# EAGLE design dragonite2 (EAGLE 6.2)
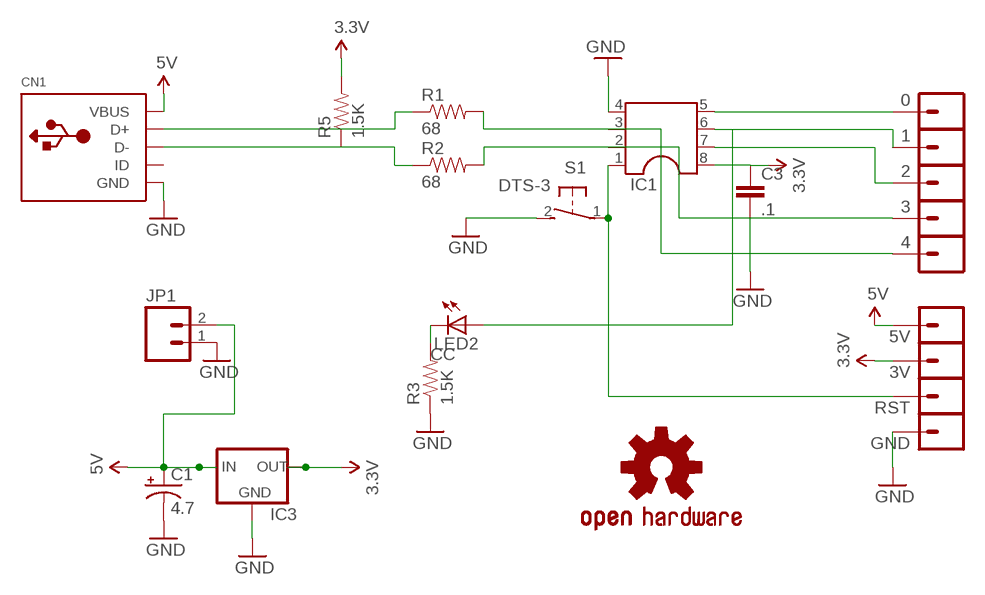
[diagram p0: schematic, sheet 1]

## Parts
0  M01SMDNS  [1X01NS]
1  M01SMDNS  [1X01NS]
2  M01SMDNS  [1X01NS]
3  M01SMDNS  [1X01NS]
3V  M01SMDNS  [1X01NS]
4  M01SMDNS  [1X01NS]
5V  M01SMDNS  [1X01NS]
C1  4.7  CPOL-USE2-4  [E2-4]
C3  .1  CAPEZ  [CAP-PTH-SMALLEZ]
CN1  USBMOLEX  [USB-MINIB-THM-MOLEX]
GND  M01SMDNS  [1X01NS]
IC1  DIL8  [DIL08]
IC3  V_REG_78XXTO-92  [TO-92]
JP1  M02JST-PTH-2  [JST-2-PTH]
LED2  LED3MM  [LED3MM]
R1  68  RESISTORPTH-1/6W  [1/6W-RES]
R2  68  RESISTORPTH-1/6W  [1/6W-RES]
R3  1.5K  RESISTORPTH-1/6W  [1/6W-RES]
R5  1.5K  RESISTORPTH-1/6W  [1/6W-RES]
RST  M01SMDNS  [1X01NS]
S1  DTS-3  [DTS-3]
U$4  OSHW-LOGOS  [OSHW-LOGO-S]

## Nets
3.3V: 3V.1 C3.1 IC1.8 IC3.3(OUT) R5.2
5V: 5V.1 C1.+ CN1.VBUS IC3.2(IN) JP1.2
GND: C1.- C3.2 CN1.GND GND.1 IC1.4 IC3.1(GND) JP1.1 R3.1 S1.2
N$1: CN1.D+ R1.1
N$2: CN1.D- R2.1 R5.1
N$3: LED2.K(C) R3.2
N$5: IC1.1 RST.1 S1.1
N$7: 4.1 IC1.3 R1.2
N$8: 3.1 IC1.2 R2.2
N$9: 0.1 IC1.5
N$10: 1.1 IC1.6 LED2.A
N$11: 2.1 IC1.7
Unconnected: CN1.ID

## Notes on the sheet
- CC

## Library data of the parts
0 1-3 3V 4 5V GND RST = SparkFun:M01: Header 1 Standard 1-pin 0.1" header. Use with straight break away headers (SKU : PRT-00116), right angle break away headers (PRT-00553), swiss pins (PRT-00743), machine pins (PRT-00117), and female headers (PRT-00115).
C1 = adafruit:CPOL-US: POLARIZED CAPACITOR, American symbol
C3 = SparkFun-Capacitors:CAP: Capacitor Standard 0603 ceramic capacitor, and 0.1" leaded capacitor.
CN1 = adafruit:USB: USB Connectors USBMINIB - Surface Mount Female Mini-B USB Connector 4UConnector: 06564 By microbuilder.eu Thru-hole RA Female Mini-B USB Connector 4UConnector: 18732 By ladyada.net
IC1 = ic-package:DIL8: Dual In Line / Socket
IC3 = SteveMarple:V_REG_78XX: Voltage Regulator Standard 7805 5V regulator. IGO (Input Ground Output). Spark Fun Electronics SKU : COM-00107
JP1 = SparkFun:M02: Header 2 Standard 2-pin 0.1" header. Use with straight break away headers (SKU : PRT-00116), right angle break away headers (PRT-00553), swiss pins (PRT-00743), machine pins (PRT-00117), and female headers (PRT-00115). Molex polarized connector foot print use with SKU : PRT-08233 with associated crimp pins and housings.
LED2 = SparkFun-LED:LED: LEDs Standard schematic elements and footprints for 5mm, 3mm, 1206, and 0603 sized LEDs. 5mm - Spark Fun Electronics SKU : COM-00529 (and others)
R1-R3 R5 = SparkFun:RESISTOR: Resistor Basic schematic elements and footprints for 0603, 1206, and PTH resistors.
S1 = switch-tact:DTS-3
U$4 = SparkFun:OSHW-LOGO: Open Source Hardware Logo This logo indicates the piece of hardware it is found on incorporates a OSHW license and/or adheres to the definition of open source hardware found here: http://freedomdefined.org/OSHW

## Board
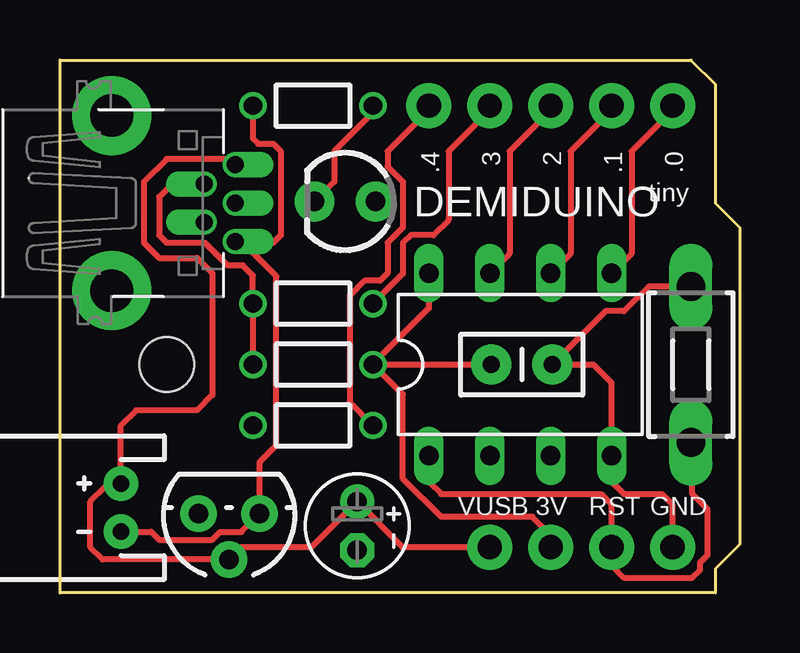
[diagram p1: board, top side]
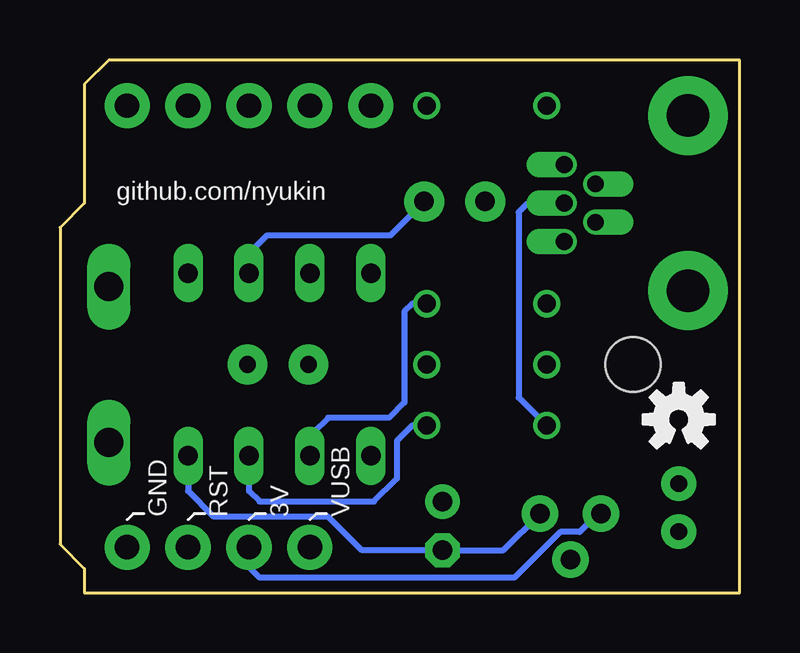
[diagram p2: board, bottom side, seen from below]

Size 28.32 x 22.23 mm. Coordinates in mm from the lower left corner, seen from the top.
Outline: 0,0 0,22.23 26.29,22.23 27.3,21.21 27.3,16.26 28.32,15.24 28.32,2.03 27.3,1.02 27.3,0 0,0
Copper layers (1*16): Top 0.0356mm / dielectric 1.5011mm / Bottom 0.0356mm
Design rules: minimum track width 6mil, minimum drill 13mil, track to track 6mil, track to pad 6mil, pad to pad 6mil, via to via 6mil, smd to smd 6mil, copper to edge 15mil, drill to drill 6mil, minimum pad ring 7mil, minimum via ring 7mil, stop-mask expansion 3mil, vias tented up to drill 14mil, thermal gap 10mil
Holes 2.29 mm at 4.45,9.53

### Footprints (pad centres in the part's own frame; a part is rotated, then mirrored left to right if it is on the bottom)
1X01NS = drill 1.016 pad 1.88: 1 0,0
E2-4 = drill 0.813 pad 1.422: + -1.016,0 | drill 0.813 pad 1.422 octagon: - 1.016,0
CAP-PTH-SMALLEZ = drill 0.7 pad 1.651: 1 0,0; 2 2.54,0
USB-MINIB-THM-MOLEX = drill 0.7 offset: D+ 0,9.72; D- -0.8,8.42; GND 1.6,9.72; ID 0.8,8.42; VBUS -1.6,9.72 | drill 1.778 pad 3.302: GND1 -3.65,4.57; GND4 3.65,4.57
DIL08 = drill 0.813 long: 1 -3.81,-3.81; 2 -1.27,-3.81; 3 1.27,-3.81; 4 3.81,-3.81; 5 3.81,3.81; 6 1.27,3.81; 7 -1.27,3.81; 8 -3.81,3.81
TO-92 = drill 0.813 pad 1.524: 1 -1.27,0; 2 0,1.905; 3 1.27,0
JST-2-PTH = drill 0.7 pad 1.448: 1 -1,0; 2 1,0
LED3MM = drill 0.813 pad 1.651: A -1.27,0; K 1.27,0
1/6W-RES = drill 0.762: 1 -2.5,0; 2 2.5,0
DTS-3 = drill 1.194 long: 1 -3.25,0; 2 3.25,0

### Placement (x,y rotation side)
0  25.53,20.32 0 top
1  22.99,20.32 0 top
2  20.45,20.32 0 top
3  17.91,20.32 0 top
3V  20.45,1.91 0 top
4  15.37,20.32 0 top
5V  17.91,1.91 0 top
C1  12.38,2.79 270 top
C3  17.97,9.53 0 top
CN1  -2.41,16.26 270 top
GND  25.53,1.91 0 top
IC1  19.18,9.53 0 top
IC3  7.05,3.3 180 top
JP1  2.54,3.56 90 top
LED2  11.87,16.32 180 top
R1  10.54,6.99 0 top
R2  10.54,12.06 0 top
R3  10.54,20.32 0 top
R5  10.54,9.53 0 top
RST  22.99,1.91 0 top
S1  26.29,9.53 90 top
U$4  2.54,7.24 0 bottom

### Tracks (layer width: path | path; a pad name or v marks a point on that pad's centre or on a via)
3.3V
  Top 0.254: 3V.1 20.45,2.41 19.68,3.17 15.88,3.17 14.29,4.76 14.29,8.28 R5.2 | R5.2 C3.1 | R5.2 13.04,9.55 15.37,11.87 IC1.8
  Bottom 0.254: IC3.3 5.91,3.3 6.67,2.54 7.48,2.54 9.38,0.64 20,0.64 20.45,1.08 3V.1
5V
  Top 0.254: 5V.1 14.29,1.91 C1.+ 10.48,1.91 7.56,1.91 IC3.2 1.78,1.4 1.27,1.91 1.27,3.81 1.91,4.45 2.43,4.45 JP1.2 2.54,6.99 3.17,7.62 5.71,7.62 6.35,8.26 6.35,13.34 5.71,13.97 4.13,13.97 3.49,14.61 3.49,17.14 4.45,18.1 6.99,18.1 7.23,17.86 CN1.VBUS
GND
  Top 0.254: GND.1 25.53,3.68 25.08,4.13 23.5,4.13 22.99,4.64 IC1.4 22.99,8.76 22.23,9.53 C3.2 22.73,11.75 23.5,11.75 24.52,12.78 S1.2 | R3.1 8.04,18.95 8.26,18.73 8.89,18.73 9.21,18.41 9.21,14.92 8.89,14.61 7.36,14.61 CN1.GND 7.57,14.66 9.02,13.21 9.02,6.16 8.32,5.46 IC3.1 7.56,2.54 6.67,2.54 6.35,2.22 4.13,2.22 3.79,2.56 JP1.1
  Bottom 0.254: IC3.1 9.84,1.78 C1.- 15.75,1.78 17.14,3.17 21.91,3.17 22.99,4.25 IC1.4
N$1
  Bottom 0.254: CN1.D+ 8.83,16.26 9.21,15.88 9.21,8.15 R1.1
N$2
  Top 0.254: CN1.D- 4.67,17.06 4.13,16.51 4.13,14.92 4.45,14.61 6.03,14.61 6.99,13.65 7.62,13.65 8.04,13.23 R2.1 R5.1
N$3
  Top 0.254: R3.2 13.04,20.03 11.43,18.41 11.43,17.14 LED2.K
N$5
  Top 0.254: IC1.1 15.37,4.64 15.88,4.13 22.54,4.13 22.99,3.68 RST.1 22.99,1.14 23.5,0.64 26.35,0.64 26.67,0.95 26.67,1.27 26.99,1.59 26.99,3.49 26.35,4.13 26.35,6.21 S1.1
N$7
  Top 0.254: R1.2 12.06,7.96 12.06,12.38 12.7,13.02 13.34,13.02 13.65,13.34 13.65,14.61 14.29,15.24 14.29,17.14 13.65,17.78 13.65,18.41 15.37,20.13 4.1
  Bottom 0.254: IC1.3 20.45,4.25 20,3.81 15.24,3.81 14.29,4.76 14.29,6.35 13.65,6.99 R1.2
N$8
  Top 0.254: R2.2 14.29,13.31 14.29,14.61 14.61,14.92 15.56,14.92 16.19,15.56 16.19,18.41 17.91,20.13 3.1
  Bottom 0.254: R2.2 13.65,12.06 13.97,11.75 13.97,7.94 14.61,7.3 17.14,7.3 17.78,6.67 17.78,5.84 IC1.2
N$9
  Top 0.254: 0.1 25.53,20.13 23.81,18.41 23.81,14.16 IC1.5
N$10
  Top 0.254: 1.1 22.99,20.13 21.27,18.41 21.27,14.16 IC1.6
  Bottom 0.254: IC1.6 20.45,14.16 19.68,14.92 14.54,14.92 LED2.A
N$11
  Top 0.254: 2.1 20.45,20.13 18.73,18.41 18.73,14.16 IC1.7

### Text on the board
tPlace: /Users/wade/2.bmp | /Users/wade/2.bmp
tNames: .4 | 3 | 2 | .1 | .0 | DEMIDUINO | tiny | VUSB | 3V | RST | GND | /Users/wade/2.bmp
bNames: github.com/nyukin | VUSB | 3V | RST | GND
200bmp: /Users/wade/2.bmp